# Altium schematic sheet Sheet1.SchDoc
size A4; SheetNumber: 1; SheetTotal: 1
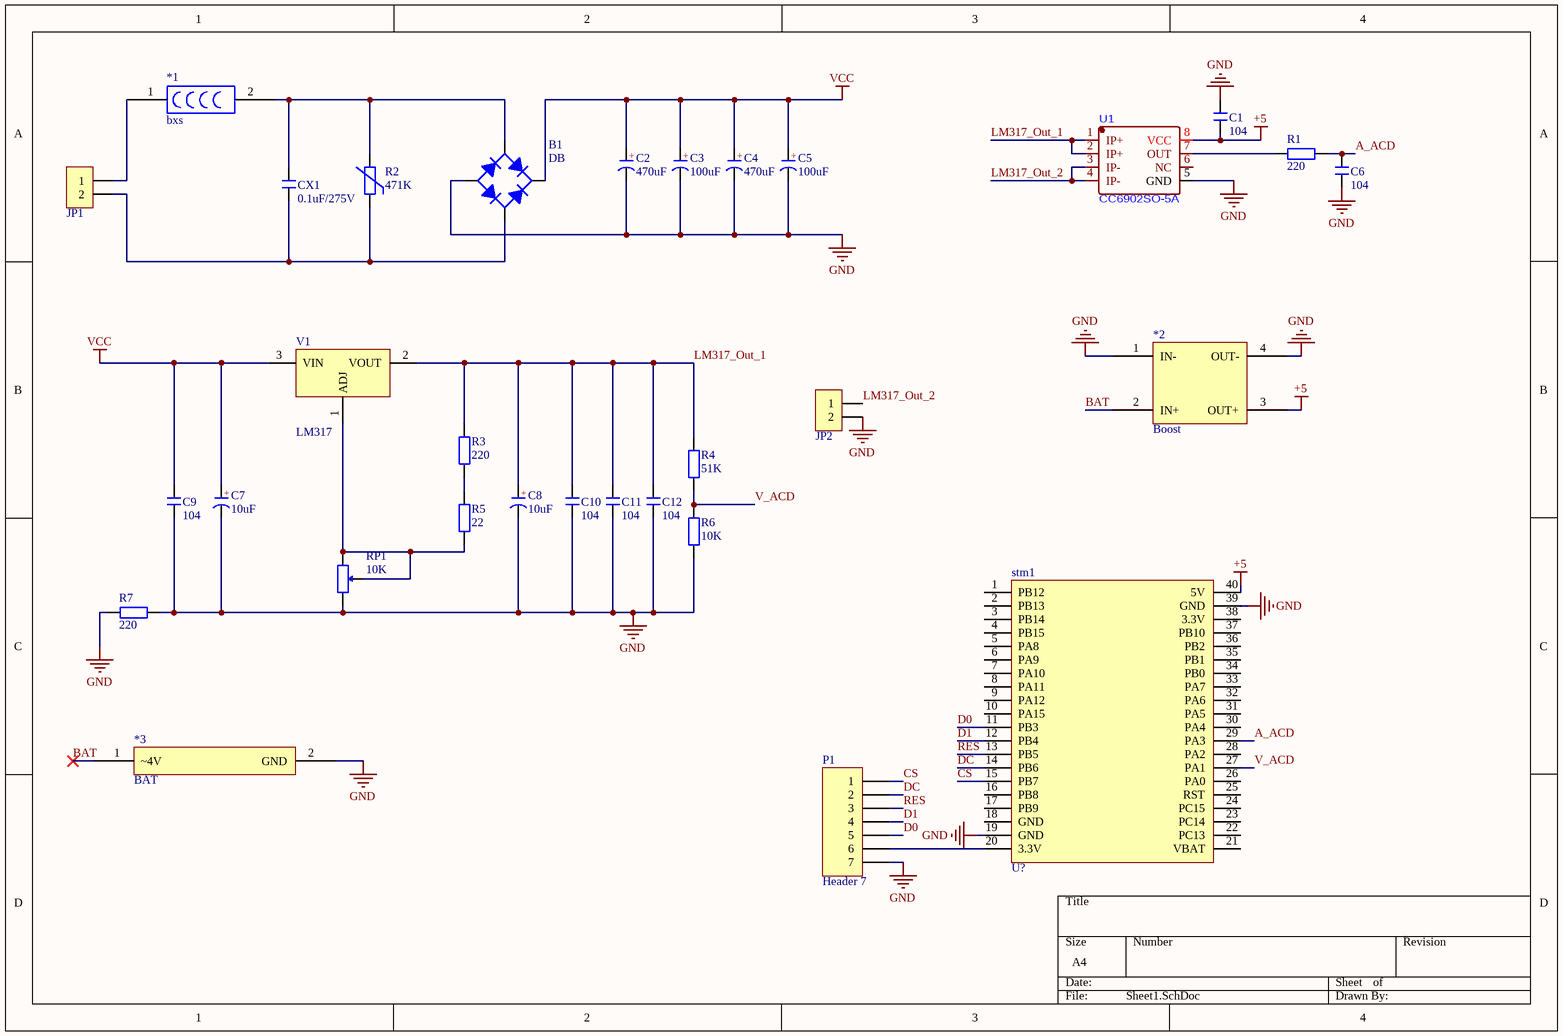
[diagram p0: Sheet1.SchDoc]

## Parts
*1  bxs  [bxs]
*2  Boost  [Boost]
*3  BAT  [BAT]
B1  DB  [GBU]
C1  104  [C 0805_M]
C2  470uF  [CAP 3.5*8*11.5]
C3  100uF  [CAP 3.5*8*11.5]
C4  470uF  [CAP 3.5*8*11.5]
C5  100uF  [CAP 3.5*8*11.5]
C6  104  [C 0805_M]
C7  10uF  [CAP 2.0*5*11]
C8  10uF  [CAP 2.0*5*11]
C9  104  [C 0805_M]
C10  104  [C 0805_M]
C11  104  [C 0805_M]
C12  104  [C 0805_M]
CX1  0.1uF/275V  [CX 10*13*11]
JP1  HDR-1X2  [KF2EDGK5.0-LI-2P]  (value not drawn)
JP2  HDR-1X2  [KF2EDGK5.0-LI-2P]  (value not drawn)
P1  Header 7  [HDR1X7]
R1  220  [R 0805_M]
R2  471K  [VDR 9D-4.5]
R3  220  [R 0805_M]
R4  51K  [R 0805_M]
R5  22  [R 0805_M]
R6  10K  [R 0805_M]
R7  220  [R 0805_M]
RP1  10K  [3296W]
stm1  U?  [stm32f4x1cxu6_core]
U1  CC6902SO-5A  [SOP-8_L4.9-W3.9-P1.27-LS6.0-BL]
V1  LM317  [TO220A]

## Nets
+5: *2.3(OUT+) C1.2 stm1.40(5V) U1.8(VCC)
GND: *2.1(IN-) *2.4(OUT-) *3.2(GND) B1.DC- C1.1 C2.2(K) C3.2(K) C4.2(K) C5.2(K) C6.2 C7.2(K) C8.2(K) C9.1 C10.1 C11.1 C12.1 JP2.2 P1.7 R6.1 R7.1 R7.2 RP1.3 stm1.19(GND) stm1.39(GND) U1.5(GND)
VCC: B1.DC+ C2.1(A) C3.1(A) C4.1(A) C5.1(A) C7.1(A) C9.2 V1.3(VIN)
A_ACD: C6.1 R1.1 stm1.29(PA3)
BAT: *2.2(IN+) *3.1(~4V)
CS: P1.1 stm1.15(PB7)
D0: P1.5 stm1.11(PB3)
D1: P1.4 stm1.12(PB4)
DC: P1.2 stm1.14(PB6)
LM317_Out_1: C8.1(A) C10.2 C11.2 C12.2 R3.2 R4.2 U1.1(IP+) U1.2(IP+) V1.2(VOUT)
LM317_Out_2: JP2.1 U1.3(IP-) U1.4(IP-)
RES: P1.3 stm1.13(PB5)
V_ACD: R4.1 R6.2 stm1.27(PA1)
Net*1_1: *1.1 JP1.1
Net*1_2: *1.2 B1.AC1 CX1.2 R2.2
NetB1_AC2: B1.AC2 CX1.1 JP1.2 R2.1
NetP1_6: P1.6 stm1.20(3.3V)
NetR1_2: R1.2 U1.7(OUT)
NetR3_1: R3.1 R5.2
NetR5_1: R5.1 RP1.1 RP1.2 V1.1(ADJ)

Not connected (* = marked no-connect by the designer): stm1 1(PB12) 2(PB13) 3(PB14) 4(PB15) 5(PA8) 6(PA9) 7(PA10) 8(PA11) 9(PA12) 10(PA15) 16(PB8) 17(PB9) 18(GND) 21(VBAT) 22(PC13) 23(PC14) 24(PC15) 25(RST) 26(PA0) 28(PA2) 30(PA4) 31(PA5) 32(PA6) 33(PA7) 34(PB0) 35(PB1) 36(PB2) 37(PB10) 38(3.3V); U1 6(NC)

## Notes on the sheet
- (in symbol CE) +

## Library data of the parts
B1 = DB: 整流桥; 淘宝ID: 小糖豆的小窝窝; BOM名称: 整流桥; 下单链接: https://item.taobao.com/item.htm?ft=t&id=613637044352
C1 C6 C9-C12 = C: 贴片电容; 淘宝ID: 小糖豆的小窝窝; BOM名称: 贴片电容; 下单链接: https://item.taobao.com/item.htm?ft=t&id=613637044352
C2-C5 C7 C8 = CE: 直插电解电容; 淘宝ID: 小糖豆的小窝窝; BOM名称: 直插电解电容; 下单链接: https://item.taobao.com/item.htm?ft=t&id=613637044352
CX1 = CX: 安规X电容; 淘宝ID: 小糖豆的小窝窝; BOM名称: 安规X电容; 下单链接: https://item.taobao.com/item.htm?ft=t&id=613637044352
JP1 JP2 = Header 2: 2P接插件; 淘宝ID: 小糖豆的小窝窝; BOM名称: 2P接插件; 下单链接: https://item.taobao.com/item.htm?ft=t&id=613637044352
P1 = Header 7: Header, 7-Pin; LatestRevisionDate: 17-Jul-2002; LatestRevisionNote: Re-released for DXP Platform.; Publisher: Altium Limited
R1 R3-R7 = R: 贴片电阻; 淘宝ID: 小糖豆的小窝窝; BOM名称: 贴片电阻; 下单链接: https://item.taobao.com/item.htm?ft=t&id=613637044352
R2 = R_VSR: 压敏电阻; 淘宝ID: 小糖豆的小窝窝; BOM名称: 压敏电阻; 下单链接: https://item.taobao.com/item.htm?ft=t&id=613637044352
RP1 = RP: 单联电位器; 淘宝ID: 小糖豆的小窝窝; BOM名称: 单联电位器; 下单链接: https://item.taobao.com/item.htm?ft=t&id=613637044352
stm1 = stm32f4x1cxu6_core
V1 = LM317: 可调线性稳压芯片; 淘宝ID: 小糖豆的小窝窝; BOM名称: 可调线性稳压芯片; 下单链接: https://item.taobao.com/item.htm?ft=t&id=613637044352